# Altium project master_board.PrjPcb
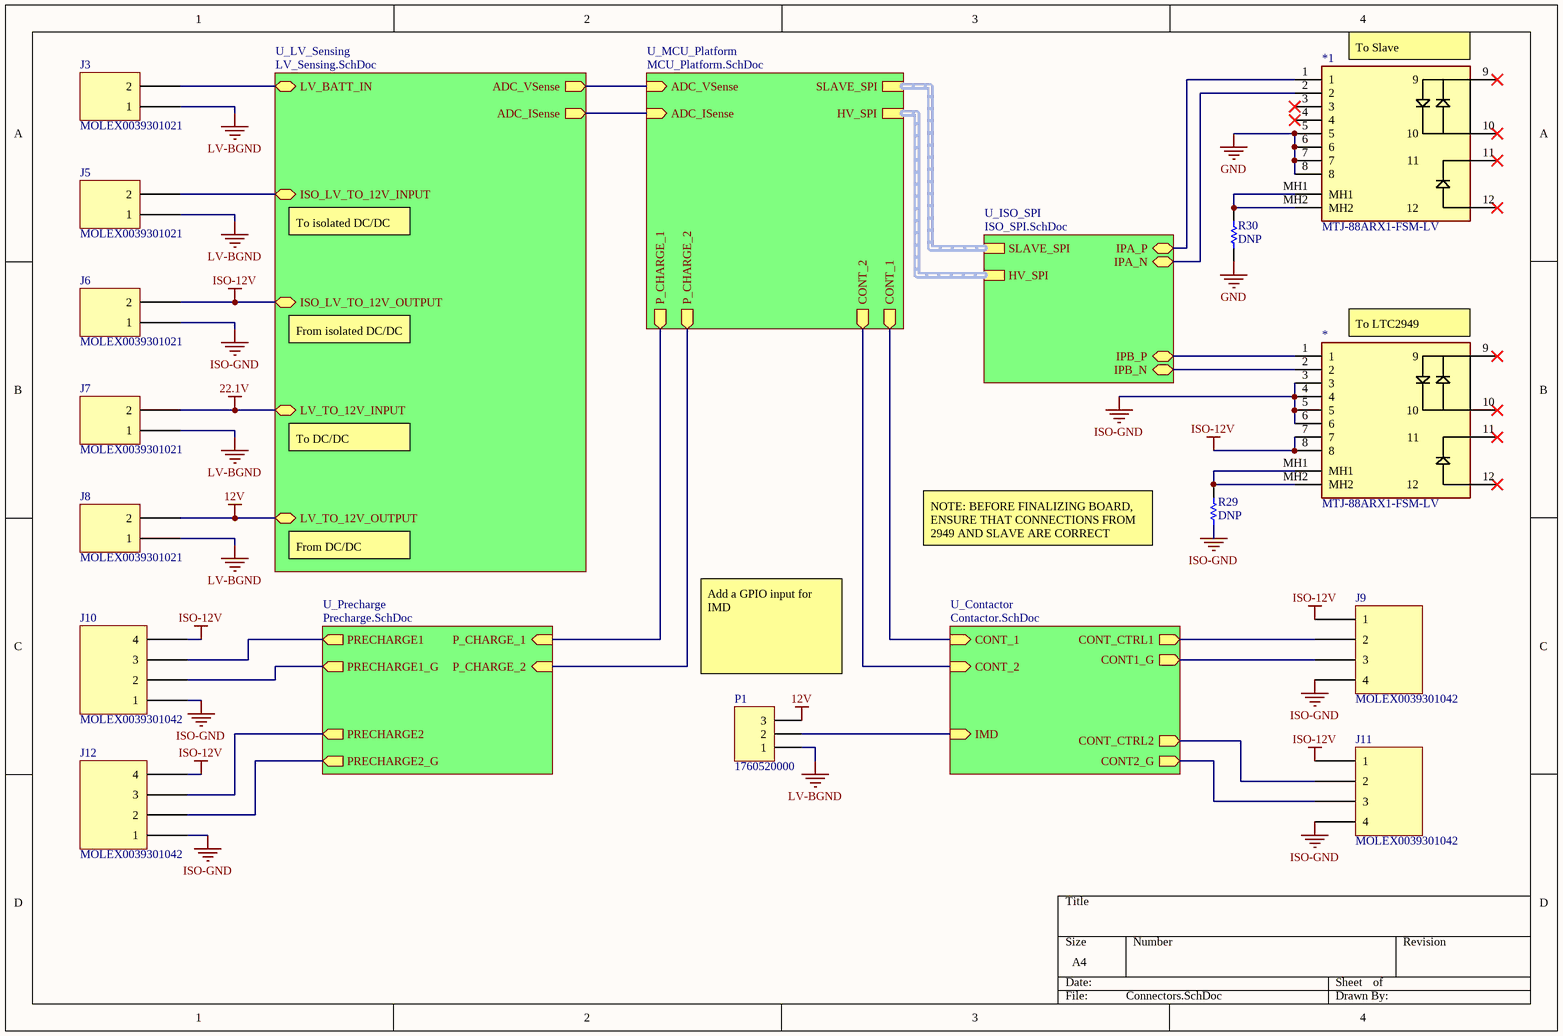
[diagram p0: Connectors.SchDoc]
6 sheets, 77 parts. Net scope: hierarchical (ports join the sheet entries above them; power ports are global).
Board file: master_rev1.PcbDoc
Sheets:
  Connectors.SchDoc
    U_Contactor = Contactor.SchDoc
    U_MCU_Platform = MCU_Platform.SchDoc
    U_ISO_SPI = ISO_SPI.SchDoc
    U_Precharge = Precharge.SchDoc
    U_LV_Sensing = LV_Sensing.SchDoc

## Sheet Connectors.SchDoc
size A4; SheetNumber: 1; SheetTotal: 6

### Parts
*  MTJ-88ARX1-FSM-LV  [MTJ-88ARX1-FSM-LV]
*1  MTJ-88ARX1-FSM-LV  [MTJ-88ARX1-FSM-LV]
J3  MOLEX0039301021  [MOLEX0039301021]
J5  MOLEX0039301021  [MOLEX0039301021]
J6  MOLEX0039301021  [MOLEX0039301021]
J7  MOLEX0039301021  [MOLEX0039301021]
J8  MOLEX0039301021  [MOLEX0039301021]
J9  MOLEX0039301042  [MOLEX0039301042]
J10  MOLEX0039301042  [MOLEX0039301042]
J11  MOLEX0039301042  [MOLEX0039301042]
J12  MOLEX0039301042  [MOLEX0039301042]
P1  1760520000  [1760520000]
R29  value DNP  [0805 - Resistor]  (hidden comment: Resistor)
R30  value DNP  [0805 - Resistor]  (hidden comment: Resistor)

### Sub-sheets
U_Contactor = Contactor.SchDoc: CONT_CTRL1 (out), CONT_CTRL2 (out), CONT1_G (out), CONT2_G (out), CONT_1 (in), CONT_2 (in), IMD (in)
U_ISO_SPI = ISO_SPI.SchDoc: IPA_P (bidir), IPA_N (bidir), IPB_P (bidir), IPB_N (bidir), SLAVE_SPI (harness SLAVE_SPI), HV_SPI (harness HV_SPI)
U_LV_Sensing = LV_Sensing.SchDoc: LV_BATT_IN (bidir), LV_TO_12V_INPUT (bidir), LV_TO_12V_OUTPUT (bidir), ISO_LV_TO_12V_INPUT (bidir), ISO_LV_TO_12V_OUTPUT (bidir), ADC_VSense (out), ADC_ISense (out)
U_MCU_Platform = MCU_Platform.SchDoc: SLAVE_SPI (harness SLAVE_SPI), HV_SPI (harness HV_SPI), P_CHARGE_1 (out), P_CHARGE_2 (out), CONT_1 (out), CONT_2 (out), ADC_VSense (in), ADC_ISense (in)
U_Precharge = Precharge.SchDoc: P_CHARGE_1 (in), P_CHARGE_2 (in), PRECHARGE1 (out), PRECHARGE2 (out), PRECHARGE1_G (out), PRECHARGE2_G (out)

### Nets
12V: J8.2 P1.3 ; sheet U_LV_Sensing/LV_TO_12V_OUTPUT
22.1V: J7.2 ; sheet U_LV_Sensing/LV_TO_12V_INPUT  [project net LV_N]
GND: *1.5 *1.6 *1.7 *1.8 R30.1
ISO-12V: *.7 *.8 J6.2 J9.1 J10.4 J11.1 J12.4 ; sheet U_LV_Sensing/ISO_LV_TO_12V_OUTPUT
ISO-GND: *.3 *.4 *.5 *.6 J6.1 J9.4 J10.1 J11.4 J12.1 R29.1
LV-BGND: J3.1 J5.1 J7.1 J8.1 P1.1
ADC_ISense: sheet U_MCU_Platform/ADC_ISense, sheet U_LV_Sensing/ADC_ISense
ADC_VSense: sheet U_MCU_Platform/ADC_VSense, sheet U_LV_Sensing/ADC_VSense
CONT_1: sheet U_Contactor/CONT_1, sheet U_MCU_Platform/CONT_1
CONT_2: sheet U_Contactor/CONT_2, sheet U_MCU_Platform/CONT_2
IMD: P1.2 ; sheet U_Contactor/IMD
IPA_N: *1.2 ; sheet U_ISO_SPI/IPA_N
IPA_P: *1.1 ; sheet U_ISO_SPI/IPA_P
IPB_N: *.2 ; sheet U_ISO_SPI/IPB_N
IPB_P: *.1 ; sheet U_ISO_SPI/IPB_P
LV_P: J3.2 J5.2 ; sheet U_LV_Sensing/LV_BATT_IN, sheet U_LV_Sensing/ISO_LV_TO_12V_INPUT
P_CHARGE_1: sheet U_MCU_Platform/P_CHARGE_1, sheet U_Precharge/P_CHARGE_1
P_CHARGE_2: sheet U_MCU_Platform/P_CHARGE_2, sheet U_Precharge/P_CHARGE_2
Net*1_MH1: *1.MH1 *1.MH2 R30.2
Net*_MH1: *.MH1 *.MH2 R29.2
NetC8_2: J10.2 ; sheet U_Precharge/PRECHARGE1_G
NetC9_2: J12.2 ; sheet U_Precharge/PRECHARGE2_G
NetC10_2: J9.3 ; sheet U_Contactor/CONT1_G
NetC11_2: J11.3 ; sheet U_Contactor/CONT2_G
NetJ9_2: J9.2 ; sheet U_Contactor/CONT_CTRL1
NetJ10_3: J10.3 ; sheet U_Precharge/PRECHARGE1
NetJ11_2: J11.2 ; sheet U_Contactor/CONT_CTRL2
NetJ12_3: J12.3 ; sheet U_Precharge/PRECHARGE2

Not connected (* = marked no-connect by the designer): * 9* 10* 11* 12*; *1 3* 4* 9* 10* 11* 12*

### Buses and harness runs
harness sheet U_ISO_SPI/HV_SPI = sheet U_MCU_Platform/HV_SPI
harness sheet U_ISO_SPI/SLAVE_SPI = sheet U_MCU_Platform/SLAVE_SPI

### Notes on the sheet
- (near *1) To Slave
- To isolated DC/DC
- From isolated DC/DC
- (near *) To LTC2949
- To DC/DC
- From DC/DC
- NOTE: BEFORE FINALIZING BOARD, ENSURE THAT CONNECTIONS FROM 2949 AND SLAVE ARE CORRECT
- (near P1) Add a GPIO input for IMD

### Library data of the parts
* *1 = MTJ-88ARX1-FSM-LV: RJ45 Connector
J3 J5-J8 = MOLEX0039301021: Connector Header Through Hole, Right Angle 2 pin 0.165" (4.20mm)
J9-J12 = MOLEX0039301042: Connector Header Through Hole, Right Angle 4 position 0.165" (4.20mm); Manufacturer: Molex; Manufacturer Part Number: 0039301042; Supplier: Digikey; Supplier Part Number: WM21364-ND; ComponentLink1Description: Datasheet; ComponentLink1URL: https://www.molex.com/pdm_docs/sd/039301042_sd.pdf
P1 = 1760520000: 1x3 Screw Terminal Block; Manufacturer: Weidmüller; Manufacturer Part Number: 1760520000; Supplier: Digikey; Supplier Part Number: 281-1883-ND; ComponentLink1Description: Datasheet; ComponentLink1URL: https://media.digikey.com/pdf/Data%20Sheets/Weidmuller%20PDFs/1760520000.pdf
R29 R30 = Resistor: Rating: *; Manufacturer Part Number: *; Manufacturer: *; Supplier Part Number: *; Supplier: *

## Sheet Contactor.SchDoc
size A4; SheetNumber: 6; SheetTotal: 6
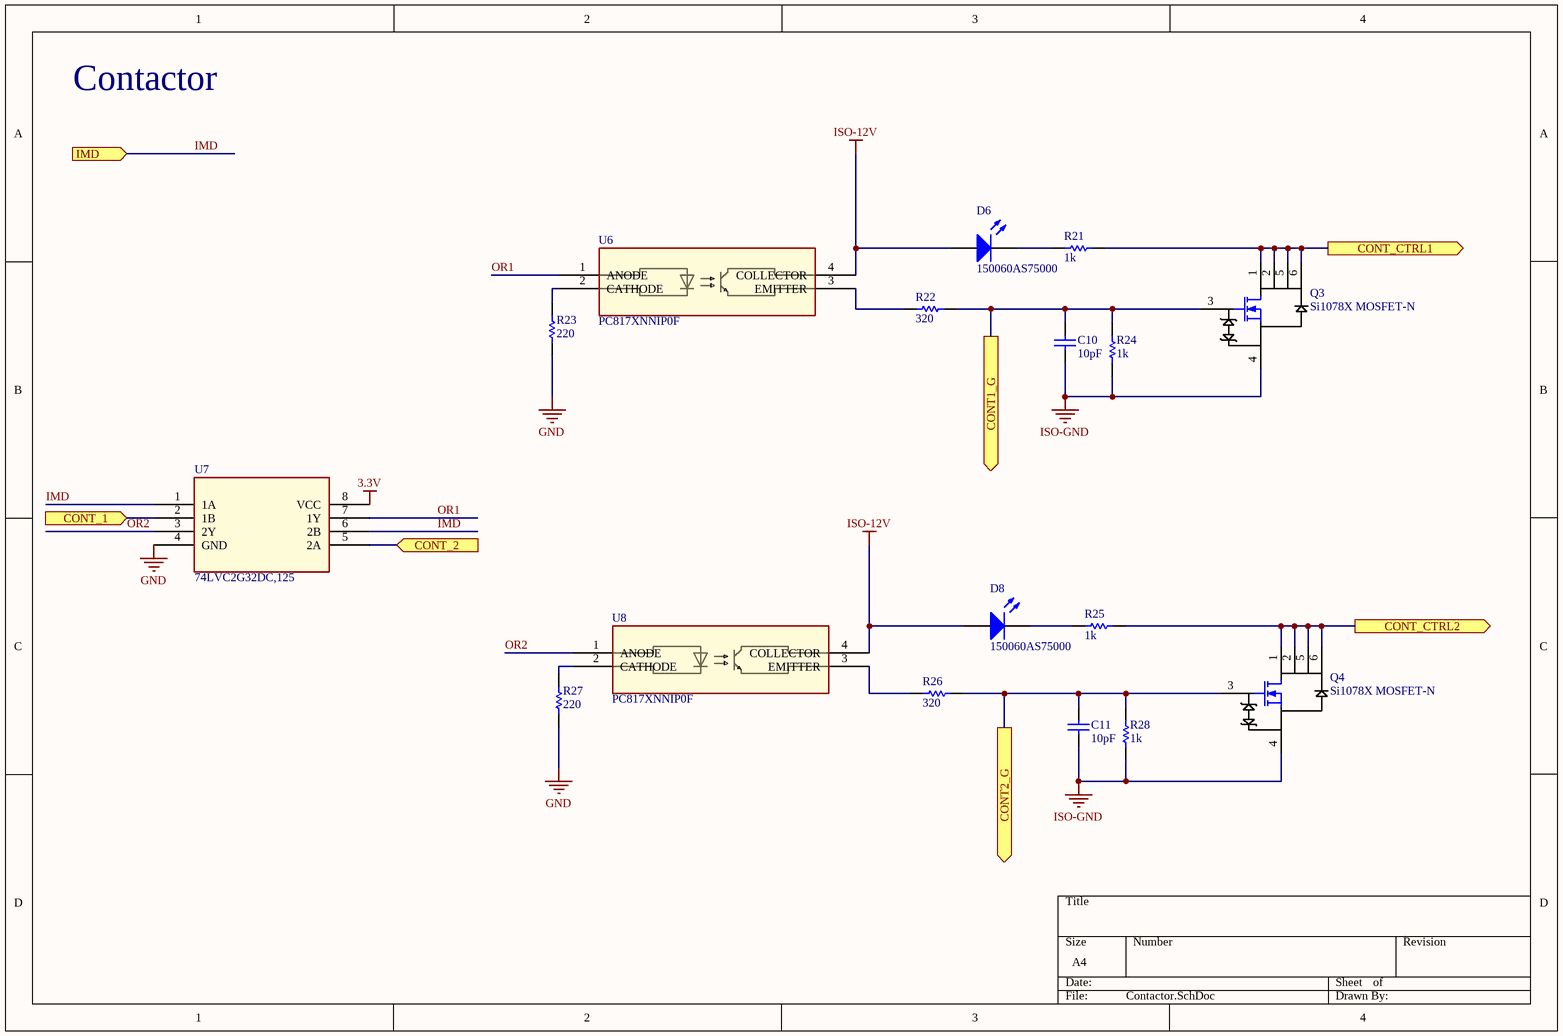
[diagram p1: Contactor.SchDoc]

### Parts
C10  value 10pF  [0603 - Capacitor]  (hidden comment: Capacitor - Nonpolarized)
C11  value 10pF  [0603 - Capacitor]  (hidden comment: Capacitor - Nonpolarized)
D6  150060AS75000  [0603 - Resistor]
D8  150060AS75000  [0603 - Resistor]
Q3  Si1078X MOSFET-N  [Si1078X NMOS 30V]
Q4  Si1078X MOSFET-N  [Si1078X NMOS 30V]
R21  value 1k  [0603 - Resistor]  (hidden comment: Resistor)
R22  value 320  [0603 - Resistor]  (hidden comment: Resistor)
R23  value 220  [0603 - Resistor]  (hidden comment: Resistor)
R24  value 1k  [0603 - Resistor]  (hidden comment: Resistor)
R25  value 1k  [0603 - Resistor]  (hidden comment: Resistor)
R26  value 320  [0603 - Resistor]  (hidden comment: Resistor)
R27  value 220  [0603 - Resistor]  (hidden comment: Resistor)
R28  value 1k  [0603 - Resistor]  (hidden comment: Resistor)
U6  PC817XNNIP0F  [PC817XNNIP0F_SHP]
U7  74LVC2G32DC,125  [VSSOP8_SOT765-1_NEX]
U8  PC817XNNIP0F  [PC817XNNIP0F_SHP]

### Ports
CONT1_G (out), CONT2_G (out), CONT_1 (in), CONT_2 (in), CONT_CTRL1 (out), CONT_CTRL2 (out), IMD (in)

### Nets
3.3V: U7.8(VCC)
GND: R23.1 R27.1 U7.4(GND)
ISO-12V: D6.1(A) D8.1(A) U6.4(COLLECTOR) U8.4(COLLECTOR)
ISO-GND: C10.1 C11.1 Q3.4 Q4.4 R24.1 R28.1
CONT_1: U7.2(1B) ; port CONT_1
CONT_2: U7.5(2A) ; port CONT_2
IMD: U7.1(1A) U7.6(2B) ; port IMD
OR1: U6.1(ANODE) U7.7(1Y)
OR2: U7.3(2Y) U8.1(ANODE)
NetC10_2: C10.2 Q3.3 R22.2 R24.2 ; port CONT1_G
NetC11_2: C11.2 Q4.3 R26.2 R28.2 ; port CONT2_G
NetD6_2: D6.2(K) R21.2
NetD8_2: D8.2(K) R25.2
NetJ9_2: Q3.1(G) Q3.2(D) Q3.5 Q3.6 R21.1 ; port CONT_CTRL1
NetJ11_2: Q4.1(G) Q4.2(D) Q4.5 Q4.6 R25.1 ; port CONT_CTRL2
NetR22_1: R22.1 U6.3(EMITTER)
NetR23_2: R23.2 U6.2(CATHODE)
NetR26_1: R26.1 U8.3(EMITTER)
NetR27_2: R27.2 U8.2(CATHODE)

### Notes on the sheet
- Contactor

### Library data of the parts
C10 C11 = Capacitor - Nonpolarized: Nonpolarized Capacitor; Supplier Part Number: *; Supplier: *; Manufacturer: *; Rating: *; Manufacturer Part Number: *
D6 D8 = LED: Amber 605nm LED Indication - Discrete 2V 0603 (1608 Metric); Manufacturer: Würth Elektronik; Value: *; Manufacturer Part Number: 150060AS75000; Supplier Part Number: 732-150060AS75000CT-ND; Rating: *; Supplier: Digi-Key
Q3 Q4 = Si1078X MOSFET-N: N-Channel 30 V (D-S) MOSFET; Manufacturer Name: Vishay Semiconductors; Manufacturer Part Number: SI1078X-T1-GE3; Supplier Name: Mouser; Supplier Part Number: 78-SI1078X-T1-GE3; ComponentLink1Description: Mouser; ComponentLink1URL: https://www.mouser.ca/ProductDetail/Vishay-Semiconductors/SI1078X-T1-GE3?qs=EBLjwc9jJJulNr1%252B%2FwN60A%3D%3D
U6 U8 = PC817XNNIP0F: Transistor Output Optocouplers Photocoupler; Manufacturer Name: Sharp; Manufacturer Part Number: PC817XNNIP0F; Type: DEV; Supplier: Mouser; Supplier Part Number: 852-PC817X3NIP1B
U7 = 74LVC2G32DC,125: IC GATE OR 2CH 2-INP 8TSSOP; Manufacturer Name: Nexperia; Manufacturer Part Number: 74LVC2G32DC,125; Supplier Name: Digikey; Supplier Part Number: 1727-5991-2-ND
R21-R28 = Resistor: Rating: *; Manufacturer Part Number: *; Manufacturer: *; Supplier Part Number: *; Supplier: *

## Sheet MCU_Platform.SchDoc
size A4; SheetNumber: 2; SheetTotal: 6
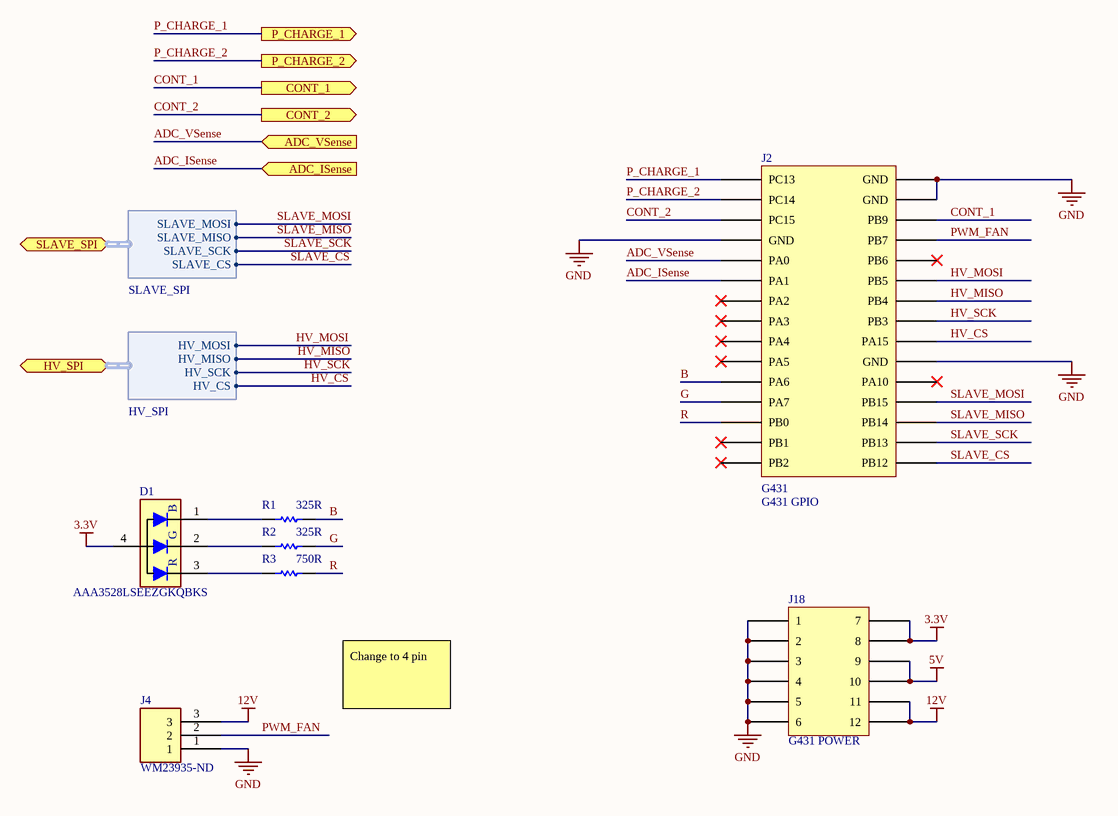
[diagram p2: MCU_Platform.SchDoc]

### Parts
D1  AAA3528LSEEZGKQBKS  [4-PLCC RGB LED]
J2  G431 GPIO  [G431 Header (GPIO Connector)]
J4  WM23935-ND  [MOLEX_39303037]
J18  G431 POWER  [G431 HEADER (POWER CONNECTOR)]
R1  value 325R  [0603 - Resistor]  (hidden comment: 1%)
R2  value 325R  [0603 - Resistor]  (hidden comment: 1%)
R3  value 750R  [0603 - Resistor]  (hidden comment: 1%)

### Ports
ADC_ISense (in), ADC_VSense (in), CONT_1 (out), CONT_2 (out), HV_SPI (bidir, harness HV_SPI), P_CHARGE_1 (out), P_CHARGE_2 (out), SLAVE_SPI (bidir, harness SLAVE_SPI)

### Harnesses
SLAVE_SPI: SLAVE_MOSI, SLAVE_MISO, SLAVE_SCK, SLAVE_CS
HV_SPI: HV_MOSI, HV_MISO, HV_SCK, HV_CS

### Nets
3.3V: D1.4 J18.7 J18.8
5V: J18.9 J18.10
12V: J4.3 J18.11 J18.12
GND: J2.4(GND) J2.16(GND) J2.17(GND) J2.25(GND) J4.1 J18.1 J18.2 J18.3 J18.4 J18.5 J18.6
ADC_ISense: J2.6(PA1) ; port ADC_ISense
ADC_VSense: J2.5(PA0) ; port ADC_VSense
B: J2.11(PA6) R1.1
CONT_1: J2.18(PB9) ; port CONT_1
CONT_2: J2.3(PC15) ; port CONT_2
G: J2.12(PA7) R2.1
HV_CS: J2.24(PA15) ; port HV_SPI.HV_CS
HV_MISO: J2.22(PB4) ; port HV_SPI.HV_MISO
HV_MOSI: J2.21(PB5) ; port HV_SPI.HV_MOSI
HV_SCK: J2.23(PB3) ; port HV_SPI.HV_SCK
P_CHARGE_1: J2.1(PC13) ; port P_CHARGE_1
P_CHARGE_2: J2.2(PC14) ; port P_CHARGE_2
PWM_FAN: J2.19(PB7) J4.2
R: J2.13(PB0) R3.1
SLAVE_CS: J2.30(PB12) ; port SLAVE_SPI.SLAVE_CS
SLAVE_MISO: J2.28(PB14) ; port SLAVE_SPI.SLAVE_MISO
SLAVE_MOSI: J2.27(PB15) ; port SLAVE_SPI.SLAVE_MOSI
SLAVE_SCK: J2.29(PB13) ; port SLAVE_SPI.SLAVE_SCK
NetD1_1: D1.1 R1.2
NetD1_2: D1.2 R2.2
NetD1_3: D1.3 R3.2

Not connected (* = marked no-connect by the designer): J2 7(PA2)* 8(PA3)* 9(PA4)* 10(PA5)* 14(PB1)* 15(PB2)* 20(PB6)* 26(PA10)*

### Notes on the sheet
- Change to 4 pin
- Title:
- Size:
- Date:
- A4
- Author:
- Revision:
- Sheet
- of
- File:
- (in symbol G431 GPIO) G431
- (in symbol RGB LED- Common Anode) B; G; R

### Library data of the parts
D1 = RGB LED- Common Anode: Red, Green, Blue (RGB) 621nm Red, 525nm Green, 465nm Blue LED Indication - Discrete 1.8V Red, 2.7V Green, 2.7V Blue 4-PLCC; Manufacturer: Kingbright; Manufacturer Part Number: AAA3528LSEEZGKQBKS; Supplier Part Number: 754-1967-1-ND; Supplier: Digi-Key
J2 = G431 GPIO: PPPC152LJBN-RC (30 Position Header Connector 0.100" (2.54mm) Through Hole, Right Angle Gold); Manufacturer Name: Sullins Connector Solutions; Manufacturer Part Number (CONN): PPPC152LJBN-RC; Supplier Name: Digikey; Supplier Part Number: S5568-ND
J4 = WM23935-ND: Conn Power HDR 3 POS 4.2mm Solder RA Thru-Hole 3 Terminal 1 Port Mini-Fit Jr Bag; MP: 39303037; MF: Molex; Package: None; Purchase-URL: https://pricing.snapeda.com/search/part/39303037/?ref=eda; Check_prices: https://www.snapeda.com/parts/39303037/Molex/view-part/?ref=eda; Value: *; SnapEDA_Link: https://www.snapeda.com/parts/39303037/Molex/view-part/?ref=snap; ComponentLink1Description: Manufacturer name; ComponentLink1URL: Molex; ComponentLink2Description: Manufacturer part number; ComponentLink2URL: 0039303037; ComponentLink3Description: Supplier name; ComponentLink3URL: Digikey; ComponentLink4Description: Supplier part number; ComponentLink4URL: WM23935-ND
J18 = G431 POWER: PPPC062LJBN-RC (12 Position Header Connector 0.100" (2.54mm) Through Hole, Right Angle Gold); Manufacturer Name: Sullins Connector Solutions; Manufacturer Part Number: PPPC062LJBN-RC; Supplier Name: Digikey; Supplier Part Number: S5559-ND
R1-R3 = Resistor: RC0603FR-07232RL, RES 232 OHM 1% 1/10W 0603; Manufacturer: YAGEO; Rating: 0.1W; Manufacturer Part Number: RC0603FR-07232RL; Supplier Part Number: 311-232HRCT-ND; Supplier: Digi-Key

## Sheet ISO_SPI.SchDoc
size A4; SheetNumber: 2; SheetTotal: 4
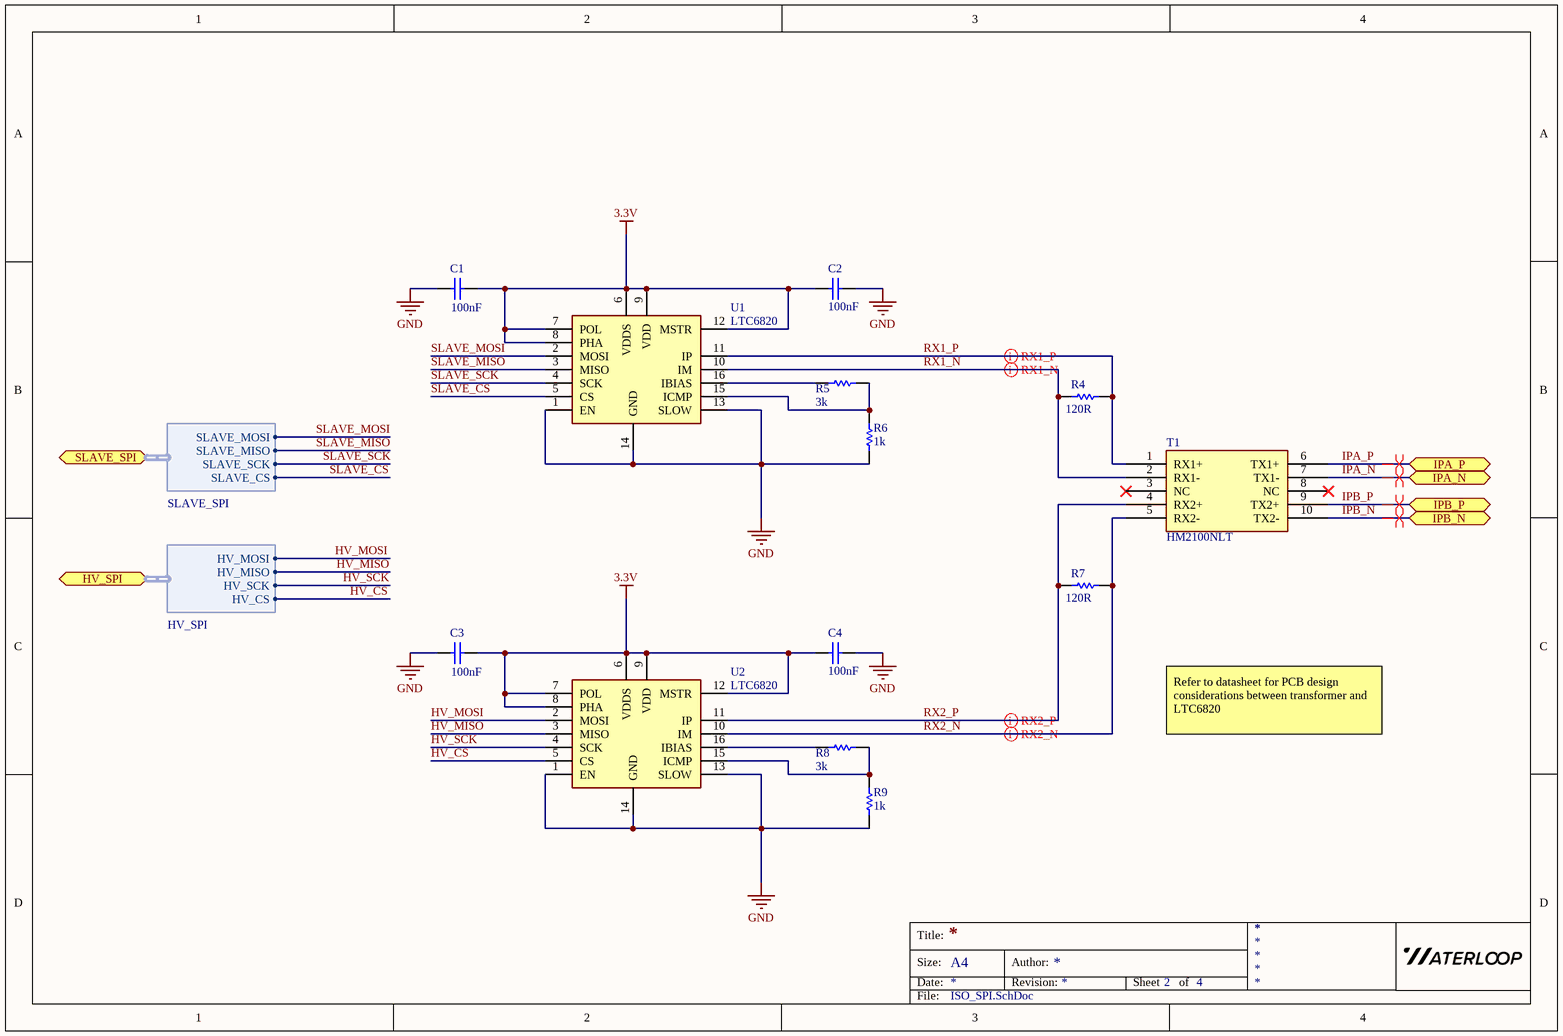
[diagram p3: ISO_SPI.SchDoc]

### Parts
C1  value 100nF  [0805 - Capacitor]  (hidden comment: 10V)
C2  value 100nF  [0805 - Capacitor]  (hidden comment: 10V)
C3  value 100nF  [0805 - Capacitor]  (hidden comment: 10V)
C4  value 100nF  [0805 - Capacitor]  (hidden comment: 10V)
R4  value 120R  [0603 - Resistor]  (hidden comment: 1%)
R5  value 3k  [0603 - Resistor]  (hidden comment: 1%)
R6  value 1k  [0603 - Resistor]  (hidden comment: 1%)
R7  value 120R  [0603 - Resistor]  (hidden comment: 1%)
R8  value 3k  [0603 - Resistor]  (hidden comment: 1%)
R9  value 1k  [0603 - Resistor]  (hidden comment: 1%)
T1  HM2100NLT  [HM2100NLT]
U1  LTC6820  [LT6820_QFN]
U2  LTC6820  [LT6820_QFN]

### Ports
HV_SPI (bidir, harness HV_SPI), IPA_N (bidir), IPA_P (bidir), IPB_N (bidir), IPB_P (bidir), SLAVE_SPI (bidir, harness SLAVE_SPI)

### Harnesses
SLAVE_SPI: SLAVE_MOSI, SLAVE_MISO, SLAVE_SCK, SLAVE_CS
HV_SPI: HV_MOSI, HV_MISO, HV_SCK, HV_CS

### Nets
3.3V: C1.2 C2.1 C3.2 C4.1 U1.6(VDDS) U1.7(POL) U1.8(PHA) U1.9(VDD) U1.12(MSTR) U2.6(VDDS) U2.7(POL) U2.8(PHA) U2.9(VDD) U2.12(MSTR)
GND: C1.1 C2.2 C3.1 C4.2 R6.1 R9.1 U1.1(EN) U1.13(SLOW) U1.14(GND) U2.1(EN) U2.13(SLOW) U2.14(GND)
HV_CS: U2.5(CS) ; port HV_SPI.HV_CS
HV_MISO: U2.3(MISO) ; port HV_SPI.HV_MISO
HV_MOSI: U2.2(MOSI) ; port HV_SPI.HV_MOSI
HV_SCK: U2.4(SCK) ; port HV_SPI.HV_SCK
IPA_N: T1.7(TX1-) ; port IPA_N
IPA_P: T1.6(TX1+) ; port IPA_P
IPB_N: T1.10(TX2-) ; port IPB_N
IPB_P: T1.9(TX2+) ; port IPB_P
RX1_N: R4.1 T1.2(RX1-) U1.10(IM)
RX1_P: R4.2 T1.1(RX1+) U1.11(IP)
RX2_N: R7.2 T1.5(RX2-) U2.10(IM)
RX2_P: R7.1 T1.4(RX2+) U2.11(IP)
SLAVE_CS: U1.5(CS) ; port SLAVE_SPI.SLAVE_CS
SLAVE_MISO: U1.3(MISO) ; port SLAVE_SPI.SLAVE_MISO
SLAVE_MOSI: U1.2(MOSI) ; port SLAVE_SPI.SLAVE_MOSI
SLAVE_SCK: U1.4(SCK) ; port SLAVE_SPI.SLAVE_SCK
NetR5_1: R5.1 U1.16(IBIAS)
NetR5_2: R5.2 R6.2 U1.15(ICMP)
NetR8_1: R8.1 U2.16(IBIAS)
NetR8_2: R8.2 R9.2 U2.15(ICMP)

Not connected (* = marked no-connect by the designer): T1 3(NC)* 8(NC)*

### Layout directives
differential pair: IPA_N, IPA_P, IPB_N, IPB_P, RX1_N, RX1_P, RX2_N, RX2_P

### Notes on the sheet
- Refer to datasheet for PCB design considerations between transformer and LTC6820
- Title:
- Size:
- Date:
- A4
- Author:
- Revision:
- Sheet
- of
- File:

### Library data of the parts
C1-C4 = Capacitor - Nonpolarized: C0805C103K8RAC7800. 10000pF ±10% 10V Ceramic Capacitor X7R 0805 (2012 Metric); Manufacturer: YAGEO; Manufacturer Part Number: CC0805MRX7R9BB103; Rating: 50V; Supplier Part Number: 311-4350-1-ND; Supplier: Digi-Key
R4 R7 = Resistor: RC0603FR-07120RL. 120 Ohms ±1% 0.1W, 1/10W Chip Resistor 0603 (1608 Metric) Moisture Resistant Thick Film; Manufacturer Part Number: RC0603FR-10120RL; Manufacturer: YAGEO; Rating: 0.1W; Supplier Part Number: 13-RC0603FR-10120RLCT-ND; Supplier: Digi-Key
R5 R8 = Resistor: RMCF0603FT3K00. 3 kOhms ±1% 0.1W, 1/10W Chip Resistor 0603 (1608 Metric) Automotive AEC-Q200 Thick Film; Manufacturer Part Number: RC0603FR-073KL; Manufacturer: YAGEO; Rating: 0.1W; Supplier Part Number: 311-3.00KHRCT-ND; Supplier: Digi-Key
R6 R9 = Resistor: RC0603FR-071KL .1 kOhms ±1% 0.1W, 1/10W Chip Resistor 0603 (1608 Metric) Moisture Resistant Thick Film; Manufacturer Part Number: RC0603JR-071KL; Manufacturer: YAGEO; Rating: 0.1W; Supplier Part Number: 311-1.0KGRCT-ND; Supplier: Digi-Key
T1 = HM2100NLT: Pulse Transformer 1:1 Surface Mount 150µH, 450µH; Manufacturer: Pulse Electronics; Datasheet: https://productfinder.pulseeng.com/doc_type/WEB301/doc_num/HM2100NL/doc_part/HM2100NL.pdf; Supplier Part Number: 1840-1032-1-ND; Supplier: Digikey; Manufacturer Part Number: HM2100NLT
U1 U2 = LTC6820: Manufacturer: Analog Devices; Manufacturer Part Number: LTC6820IMS#TRPBF; Supplier: Digikey; Supplier Part Number: LTC6820IMS#TRPBFCT-ND

## Sheet Precharge.SchDoc
size A4; SheetNumber: 5; SheetTotal: 6
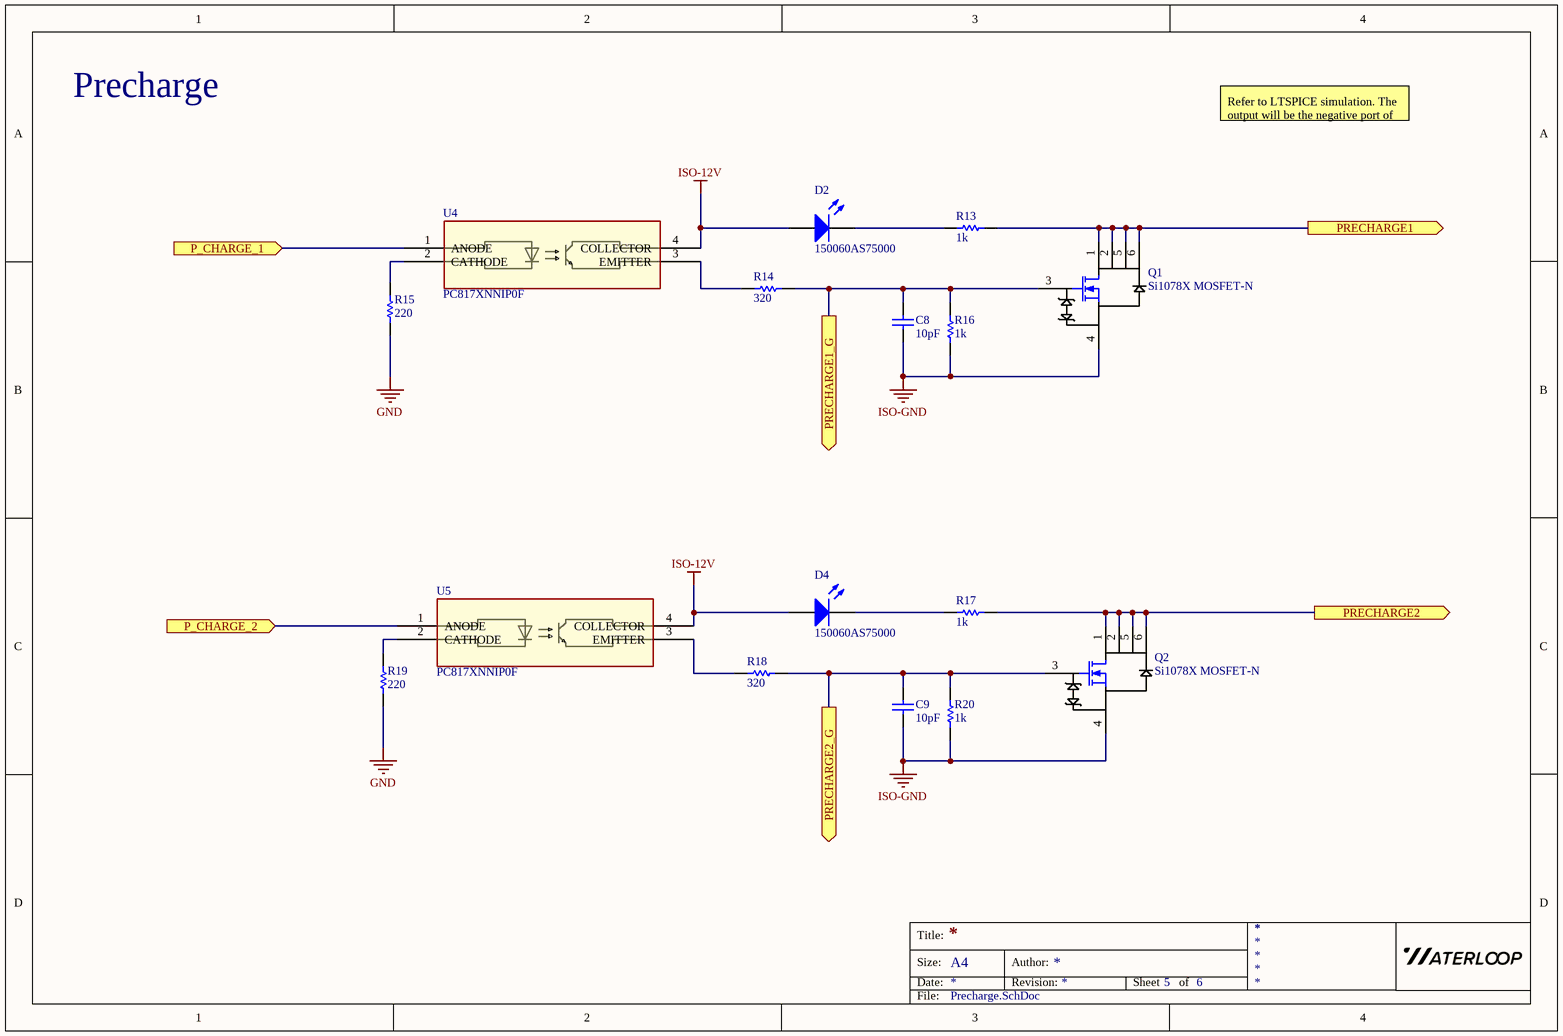
[diagram p4: Precharge.SchDoc]

### Parts
C8  value 10pF  [0603 - Capacitor]  (hidden comment: Capacitor - Nonpolarized)
C9  value 10pF  [0603 - Capacitor]  (hidden comment: Capacitor - Nonpolarized)
D2  150060AS75000  [0603 - Resistor]
D4  150060AS75000  [0603 - Resistor]
Q1  Si1078X MOSFET-N  [Si1078X NMOS 30V]
Q2  Si1078X MOSFET-N  [Si1078X NMOS 30V]
R13  value 1k  [0603 - Resistor]  (hidden comment: Resistor)
R14  value 320  [0603 - Resistor]  (hidden comment: Resistor)
R15  value 220  [0603 - Resistor]  (hidden comment: Resistor)
R16  value 1k  [0603 - Resistor]  (hidden comment: Resistor)
R17  value 1k  [0603 - Resistor]  (hidden comment: Resistor)
R18  value 320  [0603 - Resistor]  (hidden comment: Resistor)
R19  value 220  [0603 - Resistor]  (hidden comment: Resistor)
R20  value 1k  [0603 - Resistor]  (hidden comment: Resistor)
U4  PC817XNNIP0F  [PC817XNNIP0F_SHP]
U5  PC817XNNIP0F  [PC817XNNIP0F_SHP]

### Ports
P_CHARGE_1 (in), P_CHARGE_2 (in), PRECHARGE1 (out), PRECHARGE1_G (out), PRECHARGE2 (out), PRECHARGE2_G (out)

### Nets
GND: R15.1 R19.1
ISO-12V: D2.1(A) D4.1(A) U4.4(COLLECTOR) U5.4(COLLECTOR)
ISO-GND: C8.1 C9.1 Q1.4 Q2.4 R16.1 R20.1
P_CHARGE_1: U4.1(ANODE) ; port P_CHARGE_1
P_CHARGE_2: U5.1(ANODE) ; port P_CHARGE_2
NetC8_2: C8.2 Q1.3 R14.2 R16.2 ; port PRECHARGE1_G
NetC9_2: C9.2 Q2.3 R18.2 R20.2 ; port PRECHARGE2_G
NetD2_2: D2.2(K) R13.2
NetD4_2: D4.2(K) R17.2
NetJ10_3: Q1.1(G) Q1.2(D) Q1.5 Q1.6 R13.1 ; port PRECHARGE1
NetJ12_3: Q2.1(G) Q2.2(D) Q2.5 Q2.6 R17.1 ; port PRECHARGE2
NetR14_1: R14.1 U4.3(EMITTER)
NetR15_2: R15.2 U4.2(CATHODE)
NetR18_1: R18.1 U5.3(EMITTER)
NetR19_2: R19.2 U5.2(CATHODE)

### Notes on the sheet
- Precharge
- Refer to LTSPICE simulation. The output will be the negative port of the precharge/contactor circuit
- Title:
- Size:
- Date:
- A4
- Author:
- Revision:
- Sheet
- of
- File:

### Library data of the parts
C8 C9 = Capacitor - Nonpolarized: Nonpolarized Capacitor; Supplier Part Number: *; Supplier: *; Manufacturer: *; Rating: *; Manufacturer Part Number: *
D2 D4 = LED: as D6 on sheet Contactor; Value: *; Manufacturer Part Number: 150060AS75000; Supplier Part Number: 732-150060AS75000CT-ND; Rating: *; Supplier: Digi-Key
Q1 Q2 = Si1078X MOSFET-N: as Q3 on sheet Contactor; Supplier Name: Mouser; Supplier Part Number: 78-SI1078X-T1-GE3; ComponentLink1Description: Mouser; ComponentLink1URL: https://www.mouser.ca/ProductDetail/Vishay-Semiconductors/SI1078X-T1-GE3?qs=EBLjwc9jJJulNr1%252B%2FwN60A%3D%3D
U4 U5 = PC817XNNIP0F: as U6 on sheet Contactor; Manufacturer Part Number: PC817XNNIP0F; Type: DEV; Supplier: Mouser; Supplier Part Number: 852-PC817X3NIP1B
R13-R20 = Resistor: Rating: *; Manufacturer Part Number: *; Manufacturer: *; Supplier Part Number: *; Supplier: *

## Sheet LV_Sensing.SchDoc
size A4; SheetNumber: 4; SheetTotal: 6
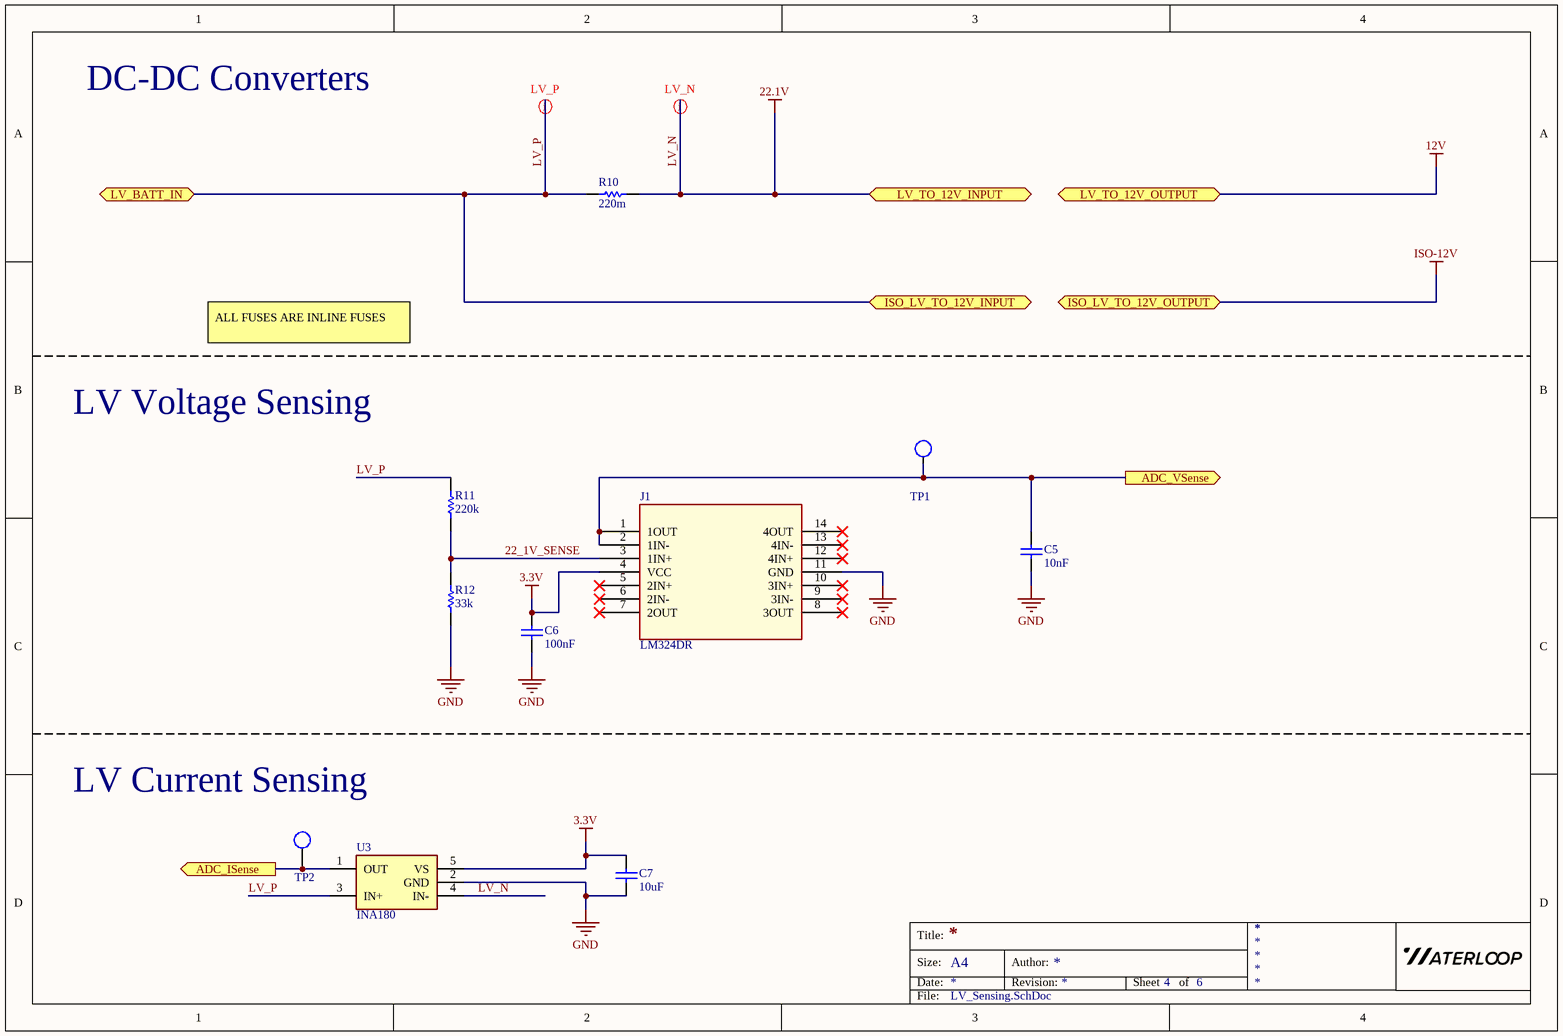
[diagram p5: LV_Sensing.SchDoc]

### Parts
C5  value 10nF  [0603 - Capacitor]  (hidden comment: Capacitor - Nonpolarized)
C6  value 100nF  [0603 - Capacitor]  (hidden comment: Capacitor - Nonpolarized)
C7  value 10uF  [0603 - Capacitor]  (hidden comment: Capacitor - Nonpolarized)
J1  LM324DR  [LM324DR]
R10  value 220m  [2512 - RESISTOR]  (hidden comment: Resistor)
R11  value 220k  [0603 - Resistor]  (hidden comment: Resistor)
R12  value 33k  [0603 - Resistor]  (hidden comment: Resistor)
TP1  Test Point  [Test Point]  (value not drawn)  (no BOM)
TP2  Test Point  [Test Point]  (value not drawn)  (no BOM)
U3  INA180  [INA180]

### Ports
ADC_ISense (out), ADC_VSense (out), ISO_LV_TO_12V_INPUT (bidir), ISO_LV_TO_12V_OUTPUT (bidir), LV_BATT_IN (bidir), LV_TO_12V_INPUT (bidir), LV_TO_12V_OUTPUT (bidir)

### Nets
3.3V: C6.2 C7.2 J1.4(VCC) U3.5(VS)
GND: C5.1 C6.1 C7.1 J1.11(GND) R12.1 U3.2(GND)
LV_N: R10.2 U3.4(IN-) ; port LV_TO_12V_INPUT  [also labelled 22.1V]
22_1V_SENSE: J1.3(1IN+) R11.2 R12.2
ADC_ISense: TP2.1 U3.1(OUT) ; port ADC_ISense
ADC_VSense: C5.2 J1.1(1OUT) J1.2(1IN-) TP1.1 ; port ADC_VSense
LV_P: R10.1 R11.1 U3.3(IN+) ; port LV_BATT_IN, port ISO_LV_TO_12V_INPUT

Not connected (* = marked no-connect by the designer): J1 5(2IN+)* 6(2IN-)* 7(2OUT)* 8(3OUT)* 9(3IN-)* 10(3IN+)* 12(4IN+)* 13(4IN-)* 14(4OUT)*

### Layout directives
differential pair: LV_N, LV_P

### Notes on the sheet
- DC-DC Converters
- ALL FUSES ARE INLINE FUSES
- LV Voltage Sensing
- LV Current Sensing
- Title:
- Size:
- Date:
- A4
- Author:
- Revision:
- Sheet
- of
- File:

### Library data of the parts
C5-C7 = Capacitor - Nonpolarized: Nonpolarized Capacitor; Supplier Part Number: *; Supplier: *; Manufacturer: *; Rating: *; Manufacturer Part Number: *
J1 = LM324DR: General Purpose Amplifier 4 Circuit 14-SOIC; Manufacturer Name: TI; Manufacturer Part Number: LM324DR; Supplier: Digikey; Supplier Part Number: 296-14597-2-ND
U3 = INA180: 0V to 26V Current Sense Amplifier; Manufacturer: Texas Instruments; Manufacturer Part Number: INA180A2IDBVR; Supplier Part Number: 296-47653-1-ND; Supplier: Digikey; ComponentLink1Description: Datasheet; ComponentLink1URL: https://www.ti.com/lit/ds/symlink/ina180.pdf?ts=1618562671692&ref_url=https%253A%252F%252Fwww.google.com%252F
R10-R12 = Resistor: Rating: *; Manufacturer Part Number: *; Manufacturer: *; Supplier Part Number: *; Supplier: *

## Nets that join several sheets
3.3V: Contactor (U7.8), MCU_Platform (D1.4 J18.7 J18.8), ISO_SPI (14 pins), LV_Sensing (C6.2 C7.2 J1.4 U3.5)
12V: Connectors (J8.2 P1.3), MCU_Platform (J4.3 J18.11 J18.12)
GND: Connectors (5 pins), Contactor (R23.1 R27.1 U7.4), MCU_Platform (11 pins), ISO_SPI (12 pins), Precharge (R15.1 R19.1), LV_Sensing (6 pins)
ISO-12V: Connectors (7 pins), Contactor (D6.1 D8.1 U6.4 U8.4), Precharge (D2.1 D4.1 U4.4 U5.4)
ISO-GND: Connectors (10 pins), Contactor (6 pins), Precharge (6 pins)
LV_N: Connectors (J7.2), LV_Sensing (R10.2 U3.4)
ADC_ISense: MCU_Platform (J2.6), LV_Sensing (TP2.1 U3.1)
ADC_VSense: MCU_Platform (J2.5), LV_Sensing (C5.2 J1.1 J1.2 TP1.1)
CONT_1: Contactor (U7.2), MCU_Platform (J2.18)
CONT_2: Contactor (U7.5), MCU_Platform (J2.3)
HV_CS: MCU_Platform (J2.24), ISO_SPI (U2.5)
HV_MISO: MCU_Platform (J2.22), ISO_SPI (U2.3)
HV_MOSI: MCU_Platform (J2.21), ISO_SPI (U2.2)
HV_SCK: MCU_Platform (J2.23), ISO_SPI (U2.4)
IMD: Connectors (P1.2), Contactor (U7.1 U7.6)
IPA_N: Connectors (*1.2), ISO_SPI (T1.7)
IPA_P: Connectors (*1.1), ISO_SPI (T1.6)
IPB_N: Connectors (*.2), ISO_SPI (T1.10)
IPB_P: Connectors (*.1), ISO_SPI (T1.9)
LV_P: Connectors (J3.2 J5.2), LV_Sensing (R10.1 R11.1 U3.3)
NetC8_2: Connectors (J10.2), Precharge (C8.2 Q1.3 R14.2 R16.2)
NetC9_2: Connectors (J12.2), Precharge (C9.2 Q2.3 R18.2 R20.2)
NetC10_2: Connectors (J9.3), Contactor (C10.2 Q3.3 R22.2 R24.2)
NetC11_2: Connectors (J11.3), Contactor (C11.2 Q4.3 R26.2 R28.2)
NetJ9_2: Connectors (J9.2), Contactor (5 pins)
NetJ10_3: Connectors (J10.3), Precharge (5 pins)
NetJ11_2: Connectors (J11.2), Contactor (5 pins)
NetJ12_3: Connectors (J12.3), Precharge (5 pins)
P_CHARGE_1: MCU_Platform (J2.1), Precharge (U4.1)
P_CHARGE_2: MCU_Platform (J2.2), Precharge (U5.1)
SLAVE_CS: MCU_Platform (J2.30), ISO_SPI (U1.5)
SLAVE_MISO: MCU_Platform (J2.28), ISO_SPI (U1.3)
SLAVE_MOSI: MCU_Platform (J2.27), ISO_SPI (U1.2)
SLAVE_SCK: MCU_Platform (J2.29), ISO_SPI (U1.4)